# Altium schematic sheet 505153_1_1.SchDoc
size Letter; CheckedBy: BC; DrawnBy: BC; Organization: space-eight.com; Address1: 343 NW 84th St; Address2: Seattle, WA; Address3: 98117; Address4: USA; DocumentNumber: 505XXX; Revision: 1; phone: (323) 791-6991; SP: SP11XXXX; Description: CIRCUIT BOARD; Revdate: --
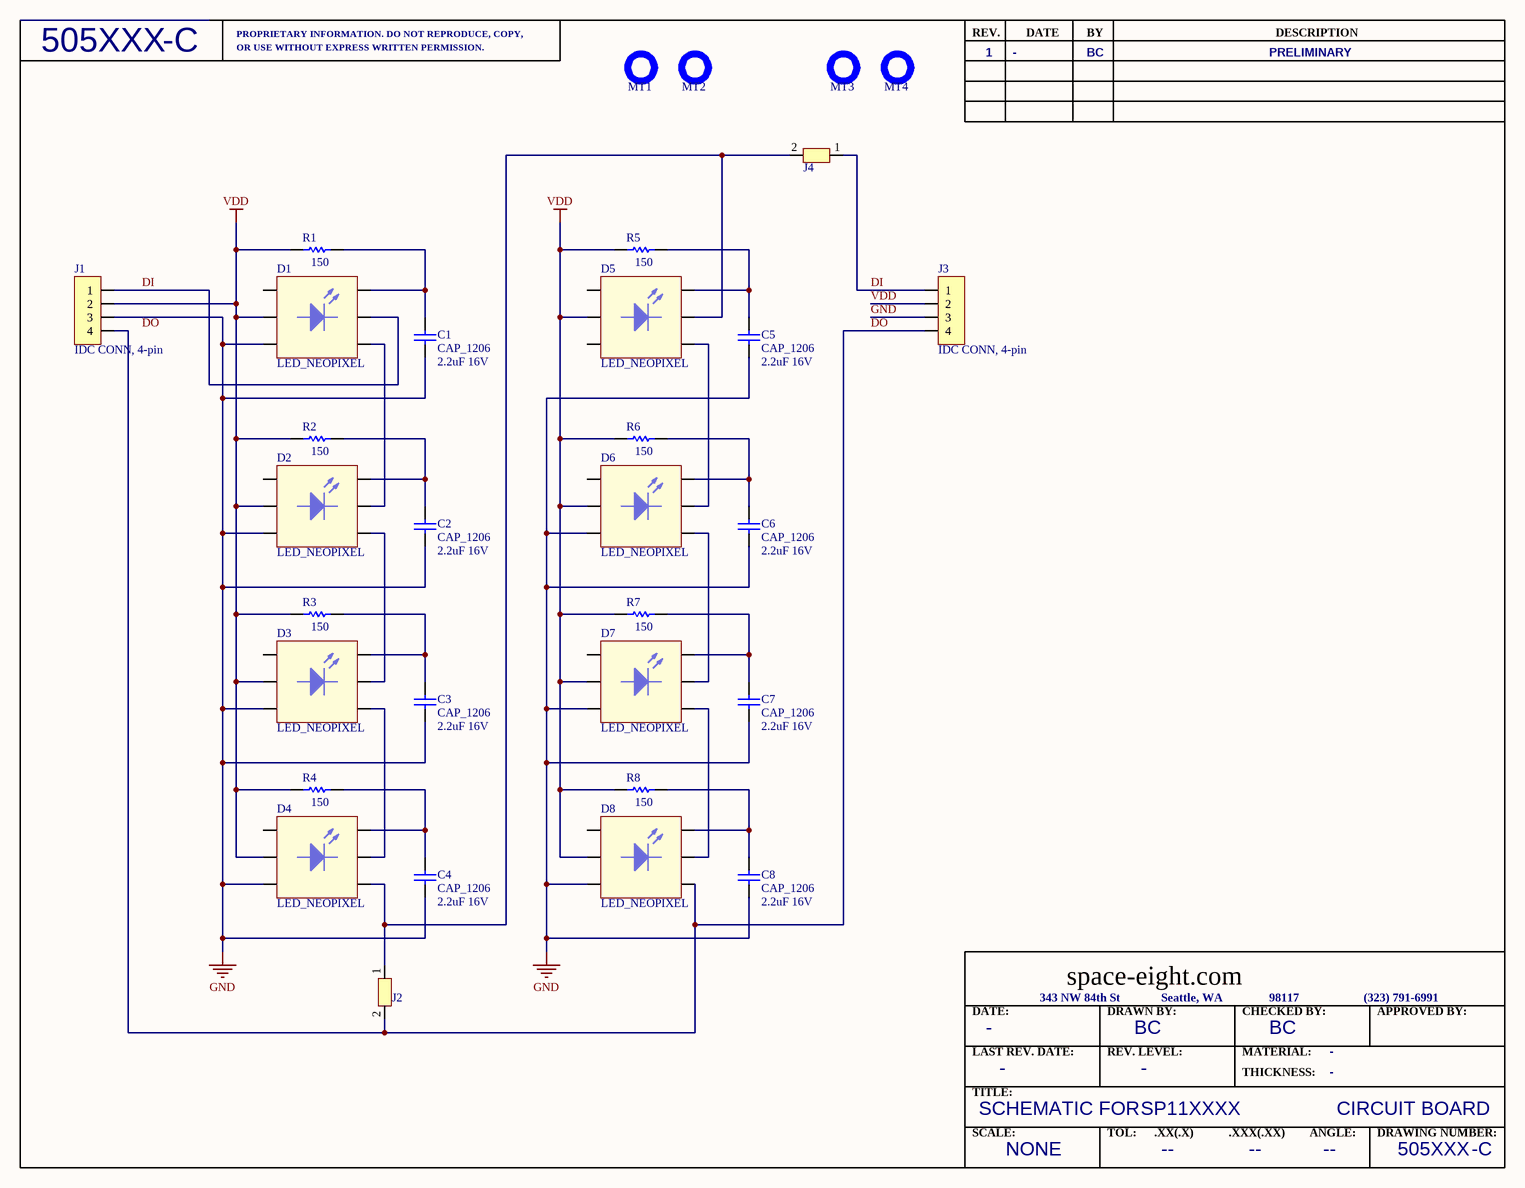
[diagram p0: 505153_1_1.SchDoc]

## Parts
C1  CAP_1206  value 2.2uF 16V  [SMT_1206_MOD]
C2  CAP_1206  value 2.2uF 16V  [SMT_1206_MOD]
C3  CAP_1206  value 2.2uF 16V  [SMT_1206_MOD]
C4  CAP_1206  value 2.2uF 16V  [SMT_1206_MOD]
C5  CAP_1206  value 2.2uF 16V  [SMT_1206_MOD]
C6  CAP_1206  value 2.2uF 16V  [SMT_1206_MOD]
C7  CAP_1206  value 2.2uF 16V  [SMT_1206_MOD]
C8  CAP_1206  value 2.2uF 16V  [SMT_1206_MOD]
D1  LED_NEOPIXEL  [NEOPIXEL]
D2  LED_NEOPIXEL  [NEOPIXEL]
D3  LED_NEOPIXEL  [NEOPIXEL]
D4  LED_NEOPIXEL  [NEOPIXEL]
D5  LED_NEOPIXEL  [NEOPIXEL]
D6  LED_NEOPIXEL  [NEOPIXEL]
D7  LED_NEOPIXEL  [NEOPIXEL]
D8  LED_NEOPIXEL  [NEOPIXEL]
J1  IDC CONN, 4-pin  [IDC_CONN_SMT_4-PIN]
J2  JUMPER_MOD  [JUMPER_SMT]  (value not drawn)
J3  IDC CONN, 4-pin  [IDC_CONN_SMT_4-PIN]
J4  JUMPER_MOD  [JUMPER_SMT]  (value not drawn)
MT1  MOUNTING HOLE  [MOUNTING HOLE]  (value not drawn)
MT2  MOUNTING HOLE  [MOUNTING HOLE]  (value not drawn)
MT3  MOUNTING HOLE  [MOUNTING HOLE]  (value not drawn)
MT4  MOUNTING HOLE  [MOUNTING HOLE]  (value not drawn)
R1  value 150  [SMT_1206_MOD]  (hidden comment: RES_1206)
R2  value 150  [SMT_1206_MOD]  (hidden comment: RES_1206)
R3  value 150  [SMT_1206_MOD]  (hidden comment: RES_1206)
R4  value 150  [SMT_1206_MOD]  (hidden comment: RES_1206)
R5  value 150  [SMT_1206_MOD]  (hidden comment: RES_1206)
R6  value 150  [SMT_1206_MOD]  (hidden comment: RES_1206)
R7  value 150  [SMT_1206_MOD]  (hidden comment: RES_1206)
R8  value 150  [SMT_1206_MOD]  (hidden comment: RES_1206)

## Nets
GND: C1.1 C2.1 C3.1 C4.1 C5.1 C6.1 C7.1 C8.1 D1.6(VSS) D2.6(VSS) D3.6(VSS) D4.6(VSS) D6.6(VSS) D7.6(VSS) D8.6(VSS) J1.3 J3.3
VDD: D1.5(VDD) D2.5(VDD) D3.5(VDD) D4.5(VDD) D5.5(VDD) D6.5(VDD) D7.5(VDD) D8.5(VDD) J1.2 J3.2 R1.1 R2.1 R3.1 R4.1 R5.1 R6.1 R7.1 R8.1
DI: D1.2(DI) J1.1 J3.1 J4.1(I/)
DO: D8.1(DO) J1.4 J2.2(O) J3.4
NetC1_2: C1.2 D1.3(VCC) R1.2
NetC2_2: C2.2 D2.3(VCC) R2.2
NetC3_2: C3.2 D3.3(VCC) R3.2
NetC4_2: C4.2 D4.3(VCC) R4.2
NetC5_2: C5.2 D5.3(VCC) R5.2
NetC6_2: C6.2 D6.3(VCC) R6.2
NetC7_2: C7.2 D7.3(VCC) R7.2
NetC8_2: C8.2 D8.3(VCC) R8.2
NetD1_1: D1.1(DO) D2.2(DI)
NetD2_1: D2.1(DO) D3.2(DI)
NetD3_1: D3.1(DO) D4.2(DI)
NetD4_1: D4.1(DO) D5.2(DI) J2.1(I/) J4.2(O)
NetD5_1: D5.1(DO) D6.2(DI)
NetD6_1: D6.1(DO) D7.2(DI)
NetD7_1: D7.1(DO) D8.2(DI)

Not connected (* = marked no-connect by the designer): D1 4(NC); D2 4(NC); D3 4(NC); D4 4(NC); D5 4(NC) 6(VSS); D6 4(NC); D7 4(NC); D8 4(NC)

## Notes on the sheet
- PROPRIETARY INFORMATION. DO NOT REPRODUCE, COPY,
- REV.
- DATE
- BY
- DESCRIPTION
- -C
- OR USE WITHOUT EXPRESS WRITTEN PERMISSION.
- 1
- -
- BC
- PRELIMINARY
- LAST REV. DATE:
- DATE:
- REV. LEVEL:
- DRAWN BY:
- MATERIAL:
- CHECKED BY:
- APPROVED BY:
- TITLE:
- SCHEMATIC FOR
- THICKNESS:
- SCALE:
- NONE
- TOL:
- .XX(.X)
- --
- .XXX(.XX)
- ANGLE:
- DRAWING NUMBER:
- Labels drawn without touching a wire or pin: DO

## Library data of the parts
C1-C8 = CAP_1206: CAP; Manufacturer: Generic Components; Class I: Passive; Class II: Capacitor; Published: 8-Jun-2000; Revision: July-2002: Re-released for DXP Platform.; Publisher: Altium Limited
D1-D8 = LED_NEOPIXEL: RGB NEOPIXEL; Manufacturer: Generic Components; Class I: Optoelectronic; Class II: LED; Published: 8-Jun-2000; Revision: July-2002: Re-released for DXP Platform.; Publisher: Altium Limited
J1 J3 = IDC CONN, 4-pin: ICD Connector, 4-Pin; Revision: 17-Jul-2002: Re-released for DXP Platform.; Publisher: Altium Limited
R1-R8 = RES_1206: RES; Manufacturer: Generic Components; Class I: Passive; Class II: Resistor; Published: 8-Jun-2000; Revision: July-2002: Re-released for DXP Platform.; Publisher: Altium Limited